# EAGLE schematic IoT Node(Ver1.0) (EAGLE 9.3.0)
test
Assembly variants: Base
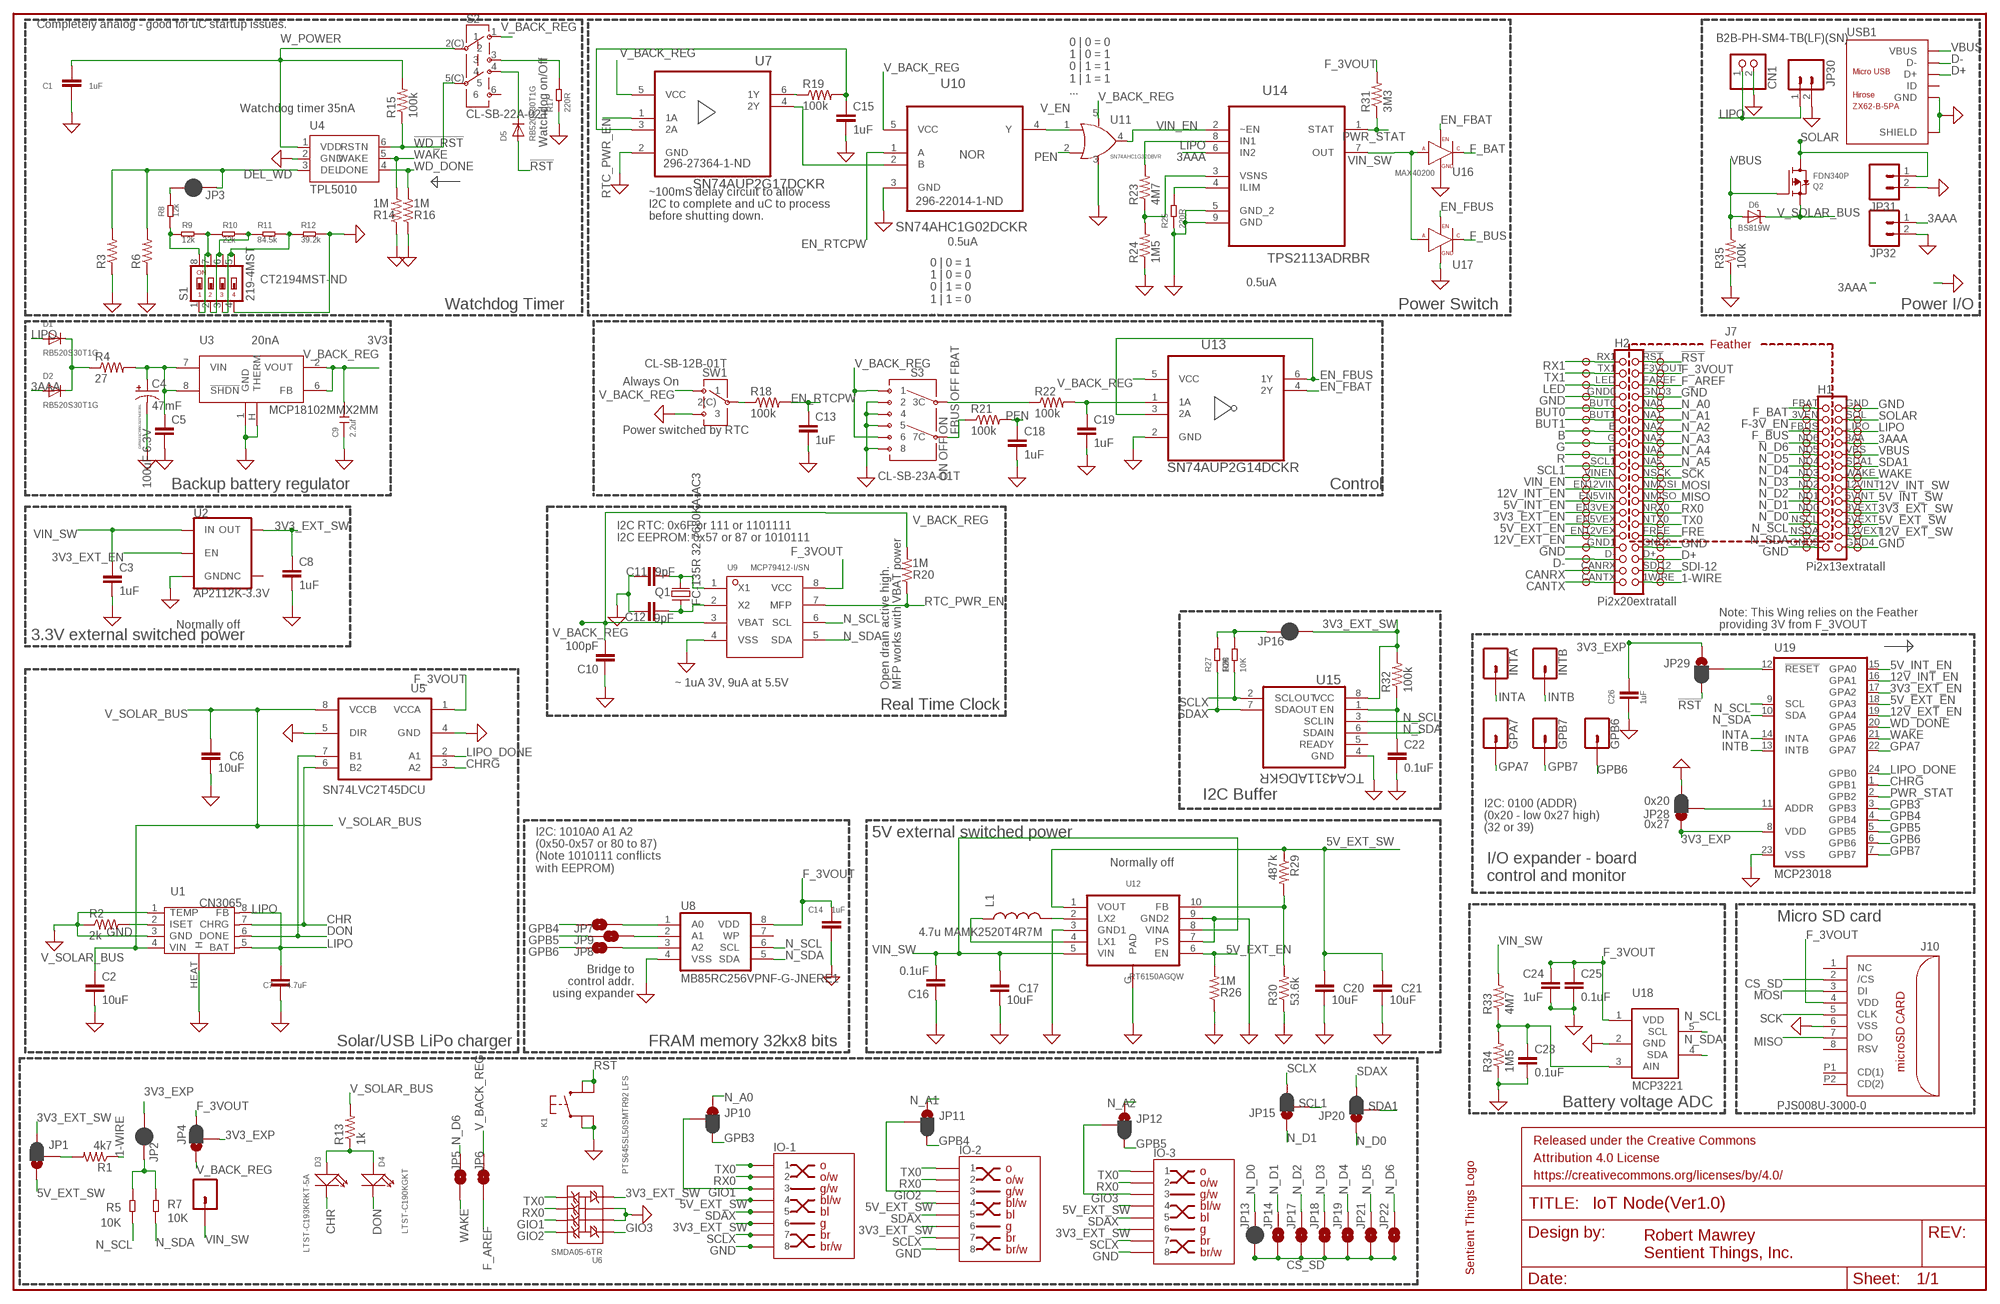
[diagram p0: schematic, sheet 1]

## Parts
C1  1uF  CAP0603-CAP  [0603-CAP]
C2  10uF  CAP0805  [0805]
C3  1uF  CAP0603-CAP  [0603-CAP]
C4  47mF  CAP_POL-SUPER  [CAP-10.5MM]
C5  100uF 6.3V  C-EUC1206  [C1206]  (not fitted in variant Base)
C6  10uF  CAP0805  [0805]
C7  4.7uF  CAP0805  [0805]
C8  1uF  CAP0603-CAP  [0603-CAP]
C9  2.2uf  CERAMIC-2.2UF-10V-10%-X7R(0603)  [C0603]
C10  100pF  CAP0805  [0805]
C11  9pF  CAP_NONE_POL  [0603]
C12  9pF  CAP_NONE_POL  [0603]
C13  1uF  CAP0603-CAP  [0603-CAP]
C14  1uF  CAP0603-CAP  [0603-CAP]
C15  1uF  CAP0603-CAP  [0603-CAP]
C16  0.1uF  0.1UF-25V(+80/-20%)(0603)  [0603-CAP]
C17  10uF  CAP0805  [0805]
C18  1uF  CAP0603-CAP  [0603-CAP]
C19  1uF  CAP0603-CAP  [0603-CAP]
C20  10uF  CAP0805  [0805]
C21  10uF  CAP0805  [0805]
C22  0.1uF  0.1UF-25V(+80/-20%)(0603)  [0603-CAP]
C23  0.1uF  0.1UF-25V(+80/-20%)(0603)  [0603-CAP]
C24  1uF  CAP0603-CAP  [0603-CAP]
C25  0.1uF  0.1UF-25V(+80/-20%)(0603)  [0603-CAP]
C26  1uF  CAP0603-CAP  [0603-CAP]
CN1  B2B-PH-SM4-TB(LF)(SN)  JST_2PIN-SMT  [JST-PH-2-SMT]
D1  RB520S30T1G  DIODESOD-523  [SOD-523]
D2  RB520S30T1G  DIODESOD-523  [SOD-523]
D3  LTST-C193KRKT-5A  LED-0603  [D0603]
D4  LTST-C190KGKT  LED-0603  [D0603]
D5  RB520S30T1G  DIODESOD-523  [SOD-523]
D6  BS819W  DIODE-SCHOTTKYSOD-123  [SOD-123]
FRAME1  FRAME-LEDGER  [CREATIVE_COMMONS]
GPA7  M01SMD-4.5X1.5  [PAD-1.5X4.5]  (not fitted in variant Base)
GPB6  M01SMD-4.5X1.5  [PAD-1.5X4.5]  (not fitted in variant Base)
GPB7  M01SMD-4.5X1.5  [PAD-1.5X4.5]  (not fitted in variant Base)
H1  Pi2x13extratall  IOTNODE2X13PLACEMENT  [2X13PLACEMENT]
H2  Pi2x20extratall  IOTNODE2X20PLACEMENT  [2X20PLACEMENT]
INTA  M01SMD-4.5X1.5  [PAD-1.5X4.5]  (not fitted in variant Base)
INTB  M01SMD-4.5X1.5  [PAD-1.5X4.5]  (not fitted in variant Base)
IO-1  RJ45-8NODE-HOR  [73304111LF]
IO-2  RJ45-8NODE-HOR  [73304111LF]
IO-3  RJ45-8NODE-HOR  [73304111LF]
J1  CONN_01  [1X01]  (not fitted in variant Base)
J5  M20IOTNODE  [M20NODE]  (not fitted in variant Base)
J6  M20IOTNODE  [M20NODE]  (not fitted in variant Base)
J7  IOTNODEDOUBLE  [IOTNODE]  (not fitted in variant Base)
J8  M13NODE  [1X13NODE]  (not fitted in variant Base)
J9  M13NODE  [1X13NODE]  (not fitted in variant Base)
J10  PJS008U-3000-0  MICROSD_SPI_MODE-VERTICAL  [MICROSDYAMAICHI]
JP1  JUMPER-SMT_3_1-NC_PASTE_NO-SILK  [SMT-JUMPER_3_1-NC_PASTE_NO-SILK]  (not fitted in variant Base)
JP2  JUMPER-SMT_2_NC_PASTE_NO-SILK  [SMT-JUMPER_2_NC_PASTE_NO-SILK]  (not fitted in variant Base)
JP3  JUMPER-SMT_2_NC_PASTE_NO-SILK  [SMT-JUMPER_2_NC_PASTE_NO-SILK]  (not fitted in variant Base)
JP4  JUMPER-SMT_3_1-NC_PASTE_NO-SILK  [SMT-JUMPER_3_1-NC_PASTE_NO-SILK]  (not fitted in variant Base)
JP5  JUMPER-SMT_2_NO_NO-SILK  [SMT-JUMPER_2_NO_NO-SILK]
JP6  JUMPER-SMT_2_NO_NO-SILK  [SMT-JUMPER_2_NO_NO-SILK]  (not fitted in variant Base)
JP7  JUMPER-SMT_2_NO_NO-SILK  [SMT-JUMPER_2_NO_NO-SILK]  (not fitted in variant Base)
JP8  JUMPER-SMT_2_NO_NO-SILK  [SMT-JUMPER_2_NO_NO-SILK]  (not fitted in variant Base)
JP9  JUMPER-SMT_2_NO_NO-SILK  [SMT-JUMPER_2_NO_NO-SILK]  (not fitted in variant Base)
JP10  JUMPER-SMT_3_1-NC_PASTE_NO-SILK  [SMT-JUMPER_3_1-NC_PASTE_NO-SILK]  (not fitted in variant Base)
JP11  JUMPER-SMT_3_1-NC_PASTE_NO-SILK  [SMT-JUMPER_3_1-NC_PASTE_NO-SILK]  (not fitted in variant Base)
JP12  JUMPER-SMT_3_1-NC_PASTE_NO-SILK  [SMT-JUMPER_3_1-NC_PASTE_NO-SILK]  (not fitted in variant Base)
JP13  JUMPER-SMT_2_NC_PASTE_NO-SILK  [SMT-JUMPER_2_NC_PASTE_NO-SILK]  (not fitted in variant Base)
JP14  JUMPER-SMT_2_NO_NO-SILK  [SMT-JUMPER_2_NO_NO-SILK]  (not fitted in variant Base)
JP15  JUMPER-SMT_3_1-NC_PASTE_NO-SILK  [SMT-JUMPER_3_1-NC_PASTE_NO-SILK]
JP16  JUMPER-SMT_2_NC_PASTE_NO-SILK  [SMT-JUMPER_2_NC_PASTE_NO-SILK]  (not fitted in variant Base)
JP17  JUMPER-SMT_2_NO_NO-SILK  [SMT-JUMPER_2_NO_NO-SILK]  (not fitted in variant Base)
JP18  JUMPER-SMT_2_NO_NO-SILK  [SMT-JUMPER_2_NO_NO-SILK]  (not fitted in variant Base)
JP19  JUMPER-SMT_2_NO_NO-SILK  [SMT-JUMPER_2_NO_NO-SILK]  (not fitted in variant Base)
JP20  JUMPER-SMT_3_1-NC_PASTE_NO-SILK  [SMT-JUMPER_3_1-NC_PASTE_NO-SILK]
JP21  JUMPER-SMT_2_NO_NO-SILK  [SMT-JUMPER_2_NO_NO-SILK]  (not fitted in variant Base)
JP22  JUMPER-SMT_2_NO_NO-SILK  [SMT-JUMPER_2_NO_NO-SILK]  (not fitted in variant Base)
JP28  JUMPER-SMT_3_1-NC_PASTE_NO-SILK  [SMT-JUMPER_3_1-NC_PASTE_NO-SILK]  (not fitted in variant Base)
JP29  JUMPER-SMT_3_1-NC_PASTE_NO-SILK  [SMT-JUMPER_3_1-NC_PASTE_NO-SILK]  (not fitted in variant Base)
JP30  M021X02_LOCK_FEM  [1X02_LOCK_FEM]  (not fitted in variant Base)
JP31  M02SOCK  [1X02-3.5-HOR]
JP32  M02PLUG  [1X02_3.5TERM]  (not fitted in variant Base)
K1  PTS645SL50SMTR92 LFS  SMD-SWITCH-TACTILE-SPST-NO(4P-D6.0MM)-TL3301  [TACTILE6MM-ESWITCH]
L1  4.7u MAMK2520T4R7M  INDUCTOR-SHIELD  [2520]
N1  SENTIENTLOGO-ULP  [SENTIENT_THINGS+50MM_TPLACE_BMP]
Q1  FC-135R 32.7680KA-AC3  Q_FC135  [FC135]
Q2  FDN340P  MOSFET-P  [SOT23-R]
R1  4k7  RESISTOR0603-RES  [0603-RES]
R2  2k  R-US_R0603  [R0603]
R3  RESISTOR0603-RES  [0603-RES]  (not fitted in variant Base)
R4  27  RESISTOR0603-RES  [0603-RES]
R5  10K  SMD-RES-10K-1%-1/10W(0603)  [R0603]
R6  RESISTOR0603-RES  [0603-RES]  (not fitted in variant Base)
R7  10K  SMD-RES-10K-1%-1/10W(0603)  [R0603]
R8  12k  SMD-RES-12K-1%-1/10W(0603)  [R0603]
R9  12k  SMD-RES-12K-1%-1/10W(0603)  [R0603]
R10  22k  SMD-RES-22K-5%-1/10W(0603)  [R0603]
R11  84.5k  R-0603  [0603]
R12  39.2k  R-0603  [0603]
R13  1k  R-US_R0603  [R0603]
R14  1M  R_0603  [0603]
R15  100k  RESISTOR0603-RES  [0603-RES]
R16  1M  R_0603  [0603]
R17  220R  SMD-RES-220R-5%-1/10W(0603)  [R0603]
R18  100k  RESISTOR0603-RES  [0603-RES]
R19  100k  RESISTOR0603-RES  [0603-RES]
R20  1M  R_0603  [0603]
R21  100k  RESISTOR0603-RES  [0603-RES]
R22  100k  RESISTOR0603-RES  [0603-RES]
R23  4M7  RESISTOR0603-RES  [0603-RES]
R24  1M5  RESISTOR0603-RES  [0603-RES]
R25  220R  SMD-RES-220R-5%-1/10W(0603)  [R0603]
R26  1M  R_0603  [0603]
R27  10K  SMD-RES-10K-1%-1/10W(0603)  [R0603]
R28  10K  SMD-RES-10K-1%-1/10W(0603)  [R0603]
R29  487k  RESISTOR0603-RES  [0603-RES]
R30  53.6k  RESISTOR0603-RES  [0603-RES]
R31  3M3  RESISTOR0603-RES  [0603-RES]
R32  100k  RESISTOR0603-RES  [0603-RES]
R33  4M7  RESISTOR0603-RES  [0603-RES]
R34  1M5  RESISTOR0603-RES  [0603-RES]
R35  100k  RESISTOR0603-RES  [0603-RES]
S1  219-4MST  SWS004  [SMS-004]
S2  CL-SB-22A-02T  SWITCH-DPDT-SMDJHOOK  [CL-SB-22A]
S3  CL-SB-23A-01T  SWITCH_DP3TSMDTOPJ  [CL-SB-23A]
SW1  CL-SB-12B-01T  SWITCH_SPDT-VERT  [CL-SB-12B]
U1  CN3065  [DFN8]
U2  AP2112K-3.3V  V_REG_AP2112K-3.3V  [SOT23-5]
U3  MCP18102MMX2MM  [8VDFN]
U4  TPL5010  [SOT23-6]
U5  SN74LVC2T45DCU  [US8-DCU]
U6  SMDA05-6TR  TVSDIODE_6-3.9MM  [SOIC-8-STANDARD]
U7  SN74AUP2G17DCKR  [SOT65P210X110-6N]
U8  MB85RC256VPNF-G-JNERE1  MB85FRAM-NARROW  [SO08]
U9  MCP79412-I/SN  RTC_MCP7941X  [RTC_MCP7941X]
U10  SN74AHC1G02DCKR  [SOT65P210X110-5N]
U11  SN74AHC1G32DBVR  OR2  [SOT23-5]
U12  RT6150AGQW  RT6150PAD  [DFN103X3]
U13  SN74AUP2G14DCKR  [SOT65P210X110-6N]
U14  TPS2113ADRBR  [SON65P300X300X100-9N]
U15  TCA4311ADGKR  TCA4311DGKR  [SOP65P490X110-8N]
U16  MAX40200  [SOT23-5]
U17  MAX40200  [SOT23-5]
U18  MCP3221  [SOT23-5]
U19  MCP23018  MCP23018MJ  [QFN24-4MM]
USB1  ZX62-B-5PA  MICRO-USB-SMD(ZX62-B-5PA)  [MICRO-USB5+6P-SMD-0.65-AB]

## Nets
1-WIRE: J6.20 J7.1WIRE R1.1
3AAA [HighCurrent]: D2.A J7.3AA J9.4 JP32.1 U14.6(IN2)
3V3_EXP [Power]: C26.1 JP2.1 JP4.2 JP28.1 JP29.1 U19.8(VDD)
3V3_EXT_EN: J5.14 J7.EN3VEX U2.3(EN) U19.17(GPA2)
3V3_EXT_SW [Power]: C8.1 IO-1.6 IO-2.6 IO-3.6 J7.3VEXT J9.10 JP1.3 JP16.1 R32.2 U2.5(OUT) U6.8 U15.8(VCC)
5V_EXT_EN: J5.15 J7.EN5VEX R26.2 U12.6(EN) U19.18(GPA3)
5V_EXT_SW [Power]: C20.1 C21.1 IO-1.4 IO-2.4 IO-3.4 J7.5VEXT J9.11 JP1.1 R29.1 U12.1(VOUT)
5V_INT_EN: J5.13 J7.EN5VIN U19.15(GPA0)
5V_INT_SW: J7.5VINT J9.9
12V_EXT_EN: J5.16 J7.EN12VEX U19.19(GPA4)
12V_EXT_SW: J7.12VEXT J9.12
12V_INT_EN: J5.12 J7.EN12VIN U19.16(GPA1)
12V_INT_SW: J7.12VINT J9.8
!RESET: JP29.2 U19.12(!RESET)
!RST: D5.A J6.1 J7.!RST JP29.3 K1.2(B0) K1.3(B1)
!WD_RST: R15.1 S2.5(C) U4.6(RSTN)
B: J5.7 J7.B
BUT0: J5.5 J7.BUT0
BUT1: J5.6 J7.BUT1
CANRX: J5.19 J7.CANRX
CANTX: J5.20 J7.CANTX
CHR: D3.- U1.7(CHRG) U5.6(B2)
CHRG: U5.3(A2) U19.1(GPB1)
CS_SD: J10.2(/CS) JP13.1 JP14.1 JP17.1 JP18.1 JP19.1 JP21.1 JP22.1
D+: J6.18 J7.D+ USB1.3(D+)
D-: J5.18 J7.D- USB1.2(D-)
DEL_WD: JP3.1 R3.2 R6.2 U4.3(DEL)
DON: D4.- U1.6(DONE) U5.7(B1)
EN_FBAT: U13.4(2Y) U16.3(EN)
EN_FBUS: U13.3(2A) U13.6(1Y) U17.3(EN)
EN_RTCPW: C13.1 R18.2 U10.1(A)
F-3V_EN: J7.3VEN J8.2
F_3VOUT [Power]: C14.1 C24.1 C25.1 J6.2 J7.F3VOUT J10.4(VDD) JP4.3 R31.2 U5.1(VCCA) U8.8(VDD) U9.8(VCC) U18.1(VDD)
F_AREF: J6.3 J7.FAREF JP6.2
F_BAT [HighCurrent]: J7.FBAT J8.1 U16.5(C)
F_BUS [HighCurrent]: J7.FBUS J8.3 U17.5(C)
FA0: JP7.2 U8.1(A0)
FA1: JP9.2 U8.2(A1)
FA2: JP8.2 U8.3(A2)
FRE: J6.16 J7.FREE
G: J5.8 J7.G
GIO1: IO-1.3 JP10.2 U6.3
GIO2: IO-2.3 JP11.2 U6.4
GIO3: IO-3.3 JP12.2 U6.5
GND [Power]: C1.2 C2.2 C3.2 C4.-VE(-) C5.2 C6.2 C7.2 C8.2 C9.1 C10.1 C11.1(ANODE) C12.1(ANODE) C13.2 C14.2 C15.2 C16.1 C17.2 C18.2 C19.2 C20.2 C21.2 C22.2 C23.2 C24.2 C25.2 C26.2 CN1.2 IO-1.8 IO-2.8 IO-3.8 J5.4 J5.17 J6.4 J6.17 J7.GND J7.GND0 J7.GND1 J7.GND2 J7.GND3 J7.GND4 J7.GND5 J8.13 J9.1 J9.13 J10.6(VSS) JP28.3 JP30.2 JP31.2 JP32.2 K1.1(A0) K1.4(A1) R2.1 R3.1 R6.1 R12.2 R14.1 R16.1 R17.1 R24.1 R25.1 R26.1 R30.1 R34.1 R35.1 S1.4 S3.2 S3.4 S3.5 S3.8 SW1.3 U1.1(TEMP) U1.3(GND) U1.HEAT(H) U2.2(GND) U3.1(GND) U3.H(THERM) U4.2(GND) U5.4(GND) U5.5(DIR) U6.6 U6.7 U7.2(GND) U8.4(VSS) U9.4(VSS) U10.3(GND) U11.3(G) U12.3(GND1) U12.7(PS) U12.9(GND2) U12.G(PAD) U13.2(GND) U14.5(GND_2) U14.9(GND) U15.4(GND) U16.2(G) U17.2(G) U18.2(GND) U19.23(VSS) USB1.5(GND) USB1.P1(SHIELD) USB1.P2(SHIELD) USB1.P3(SHIELD) USB1.P4(SHIELD) USB1.P5(SHIELD) USB1.P6(SHIELD)
GPA7: GPA7.P$1 U19.22(GPA7)
GPB3: JP10.3 U19.3(GPB3)
GPB4: JP7.1 JP11.3 U19.4(GPB4)
GPB5: JP9.1 JP12.3 U19.5(GPB5)
GPB6: GPB6.P$1 JP8.1 U19.6(GPB6)
GPB7: GPB7.P$1 U19.7(GPB7)
I2CPWR: JP2.2 R5.2 R7.2
INTA: INTA.P$1 U19.14(INTA)
INTB: INTB.P$1 U19.13(INTB)
LED: J5.3 J7.LED
LIPO [HighCurrent]: C7.1 CN1.1 D1.A J7.LIPO J9.3 JP30.1 R23.2 U1.5(BAT) U1.8(FB) U14.8(IN1)
LIPO_DONE: U5.2(A1) U19.24(GPB0)
MISO: J6.13 J7.NMISO J10.7(DO)
MOSI: J6.12 J7.NMOSI J10.3(DI)
N$1: JP3.2 R8.2
N$2: R2.2 U1.2(ISET)
N$3: R17.2 S2.3
N$4: R19.1 U7.6(1Y)
N$5: D3.+ D4.+ R13.1
N$6: R18.1 SW1.C(2)(2(C))
N$7: R25.2 U14.4(ILIM)
N$8: JP28.2 U19.11(ADDR)
N$9: R23.1 R24.2 U14.3(VSNS)
N$10: D1.K(C) D2.K(C) R4.1
N$11: D5.K(C) S2.4
N$12: C15.1 R19.2 U7.3(2A)
N$13: C11.2(CATHODE) Q1.X2 U9.1(X1)
N$14: C12.2(CATHODE) Q1.X1 U9.2(X2)
N$15: JP1.2 R1.2
N$16: U7.4(2Y) U10.2(B)
N$17: R9.2 R10.1 S1.1 S1.7
N$18: R10.2 R11.1 S1.2 S1.6
N$19: R11.2 R12.1 S1.3 S1.5
N$20: R8.1 R9.1 S1.8
N$21: C23.1 R33.1 R34.2 U18.3(AIN)
N$22 [Power]: JP16.2 R27.2 R28.2
N$23: L1.L2 U12.2(LX2)
N$24: L1.L1 U12.4(LX1)
N$25: R29.2 R30.2 U12.10(FB)
N$26: R21.1 S3.7(C)(7C)
N$27: C22.1 R32.1 U15.1(EN)
N$29: C19.1 R22.2 U13.1(1A)
N$33: R22.1 S3.3(C)(3C)
N_A0: J6.5 J7.NA0 JP10.1
N_A1: J6.6 J7.NA1 JP11.1
N_A2: J6.7 J7.NA2 JP12.1
N_A3: J6.8 J7.NA3
N_A4: J6.9 J7.NA4
N_A5: J6.10 J7.NA5
N_D0: J7.ND0 J8.10 JP13.2 JP20.1
N_D1: J7.ND1 J8.9 JP14.2 JP15.1
N_D2: J7.ND2 J8.8 JP17.2
N_D3: J7.ND3 J8.7 JP18.2
N_D4: J7.ND4 J8.6 JP19.2
N_D5: J7.ND5 J8.5 JP21.2
N_D6: J7.ND6 J8.4 JP5.1 JP22.2
N_SCL: J7.NSCL J8.11 R5.1 U8.6(SCL) U9.6(SCL) U15.3(SCLIN) U18.5(SCL) U19.9(SCL)
N_SDA: J7.NSDA J8.12 R7.1 U8.5(SDA) U9.5(SDA) U15.6(SDAIN) U18.4(SDA) U19.10(SDA)
PEN: C18.1 R21.2 U11.2(B)
PWR_STAT: R31.1 U14.1(STAT) U19.2(GPB2)
R: J5.9 J7.R
RTC_PWR_EN: R20.1 U7.1(1A) U9.7(MFP)
RX0: IO-1.2 IO-2.2 IO-3.2 J6.14 J7.NRX0 U6.2
RX1: J5.1 J7.RX1
SCK: J6.11 J7.NSCK J10.5(CLK)
SCL1: J5.10 J7.SCL1 JP15.2
SCLX: IO-1.7 IO-2.7 IO-3.7 JP15.3 R28.1 U15.2(SCLOUT)
SDA1: J7.SDA1 J9.6 JP20.2
SDAX: IO-1.5 IO-2.5 IO-3.5 JP20.3 R27.1 U15.7(SDAOUT)
SDI-12: J6.19 J7.SDI12
SOLAR [Power]: J7.SOL J9.2 JP31.1 Q2.3(D)
TX0: IO-1.1 IO-2.1 IO-3.1 J6.15 J7.NTX0 U6.1
TX1: J5.2 J7.TX1
V_BACK: C4.+VE(+) C5.1 R4.2 U3.7(VIN) U3.8(!SHDN)
V_BACK_REG: C9.2 C10.2 JP4.1 JP6.1 R20.2 S2.1 S3.1 S3.6 SW1.1 U3.2(VOUT) U3.6(FB) U7.5(VCC) U9.3(VBAT) U10.5(VCC) U11.5(V) U13.5(VCC)
V_EN: U10.4(Y) U11.1(A)
V_SOLAR_BUS: C2.1 C6.1 D6.C Q2.2(S) R13.2 U1.4(VIN) U5.8(VCCB)
VBUS [Power]: D6.A J7.VBS J9.5 Q2.1(G) R35.2 USB1.1(VBUS)
VIN_EN: J5.11 J7.VINEN U11.4(Y) U14.2(~EN)
VIN_SW [HighCurrent]: C3.1 C16.2 C17.1 J1.1 R33.2 U2.1(IN) U12.5(VIN) U12.8(VINA) U14.7(OUT) U16.1(A) U17.1(A)
W_POWER: C1.1 R15.2 S2.2(C) U4.1(VDD)
WAKE: J7.WAKE J9.7 JP5.2 R14.2 U4.5(WAKE) U19.21(GPA6)
WD_DONE: R16.2 U4.4(DONE) U19.20(GPA5)
Unconnected: J10.1(NC) J10.8(RSV) J10.P1(CD(1)) J10.P2(CD(2)) S2.6 U2.4(NC) U8.7(WP) U15.5(READY) USB1.4(ID)

## Notes on the sheet
- Completely analog - good for uC startup issues.
- 0 | 0 = 0
  1 | 0 = 1
  0 | 1 = 1
  1 | 1 = 1
  ...
- Watchdog timer 35nA
- Watchdog on/Off
- NOR
- 296-27364-1-ND
- ~100mS delay circuit to allow
  I2C to complete and uC to process
  before shutting down.
- 296-22014-1-ND
- 0.5uA
- CT2194MST-ND | 0.5uA
- Watchdog Timer | Power Switch | Power I/O
- 0 | 0 = 1
  1 | 0 = 0
  0 | 1 = 0
  1 | 1 = 0
  ...
- 20nA | 3V3
- Always On
  
  
  
  Power switched by RTC
- FBUS OFF FBAT
- GRM31CR60J107ME39L
- Backup battery regulator | ON OFF ON
- Control
- I2C RTC: 0x6F or 111 or 1101111
  I2C EEPROM: 0x57 or 87 or 1010111
- Normally off
- Note: This Wing relies on the Feather
  providing 3V from F_3VOUT
- 3.3V external switched power
- ~ 1uA 3V, 9uA at 5.5V
- Open drain active high.
  MFP works with VBAT power
- Real Time Clock
- I2C Buffer | 0x20
- 0x27
- I2C: 0100 (ADDR) 
  (0x20 - low 0x27 high)
  (32 or 39)
- 5V external switched power
- Normally off
- I2C: 1010A0 A1 A2
  (0x50-0x57 or 80 to 87)
  (Note 1010111 conflicts
  with EEPROM)
- I/O expander - board
  control and monitor
- Micro SD card
- Bridge to
  control addr.
  using expander
- Solar/USB LiPo charger | FRAM memory 32kx8 bits
- Battery voltage ADC
- Robert Mawrey
  Sentient Things, Inc.

## Library data of the parts
C1 C3 C8 C13-C15 C18 C19 C24 C26 = Mawrey:CAP: Capacitor Standard 0603 ceramic capacitor, and 0.1" leaded capacitor.; PARTNO: CL10A105KP8NNNC
C2 C6 C17 C20 C21 = Mawrey:CAP: Capacitor Standard 0603 ceramic capacitor, and 0.1" leaded capacitor.; PARTNO: CL21A106KPFNNNE
C4 = Mawrey:CAP_POL: Capacitor Polarized These are standard SMD and PTH capacitors. Normally 10uF, 47uF, and 100uF in electrolytic and tantalum varieties. Always verify the external diameter of the through hole cap, it varies with capacity, voltage, and manufacturer. The EIA devices should be standard.; DESCRIPTION: CAP SUPER 0.33F 5.5V RADIAL; EACH: 1.0346; MFPN: EEC-S0HD334V; MFR: Panasonic - ECG; PARTNO: FC0H473ZFTBR24; VEND: Digi-Key; VPN: P11065-ND
C5 = rcl:C-EU: CAPACITOR, European symbol; PARTNO: DNP; SPICEPREFIX: C
C7 = Mawrey:CAP: Capacitor Standard 0603 ceramic capacitor, and 0.1" leaded capacitor.; PARTNO: CL10A475KP8NNNC
C9 = Seeed-Capacitor:CERAMIC-2.2UF-10V-10%-X7R(0603): 302010054; MPN: CC0603KRX7R6BB225; PARTNO: CL10A106MQ8NNNC
C10 = Mawrey:CAP: Capacitor Standard 0603 ceramic capacitor, and 0.1" leaded capacitor.; DESCRIPTION: CAP CER 100PF 50V 5% NP0 0805; EACH: 0.036; MFPN: 500R15N101JV4T; MFR: Johanson Dielectrics Inc; PARTNO: CL21C101JC61PNC; VEND: Digi-Key; VPN: 709-1176-1-ND
C11 C12 = Particle:CAP_NONE_POL; PARTNO: C1608C0G1H090D080AA
C16 C22 C23 C25 = SparkFun-Capacitors:0.1UF-25V(+80/-20%)(0603): CAP-00810 Ceramic Standard decoupling cap; PARTNO: CL10F104ZB8NNNC; PROD_ID: CAP-00810
CN1 = Mawrey:JST_2PIN: JST 2-Pin Connectors of various flavors SMT-RA (S2B-PH-SM4) 4UConnector #17311 SMT (B2B-PH-SM4) THM-RA (S2B-PH) THM (B2B-PH); PARTNO: B2B-PH-SM4-TB(LF)(SN)?
D1 D2 D5 = adafruit:DIODE: Diode SMADIODE - SMA Surface Mount Package 20V 1A Schottky Diode Digikey: 641-1014-6-ND DO-1N4148 - Through Hole Small Current Diode SOD-123 20V 1 A (.5mV Vf) Schottky Diode - Digikey: MBRX120TPMSCT-ND SOD-323 10V 570mA (.38mV Vf, 3ns) Schottky Diode - Digikey: ZLLS410CT-ND SOD-523 30V 30mA Schottky Diode (RB751S-40TE61) - Digikey: RB751S-40TE61CT-ND SOT23-R/W - SOT23 Package (R = Solder Paste/Reflow Ovens, W = Hand-Soldering) BAT54Film 40V 300mA - Digikey: 497-7162-1-ND; PARTNO: RB520S30T1G
D3 = discrete:LED*; PARTNO: LTST-C193KRKT-5A
D4 = discrete:LED*; PARTNO: LTST-C190KGKT
D6 = microbuilder:DIODE-SCHOTTKY; PARTNO: B5819WS-TP
FRAME1 = mawrey-aesthetics:FRAME-LEDGER: Schematic Frame Standard 11x14 US Ledger frame
GPA7 GPB6 GPB7 INTA INTB = Mawrey:M01: Header 1 Standard 1-pin 0.1" header. Use with straight break away headers (SKU : PRT-00116), right angle break away headers (PRT-00553), swiss pins (PRT-00743), machine pins (PRT-00117), and female headers (PRT-00115).; PARTNO: DNP
H1 = Mawrey:IOTNODE2X13PLACEMENT; PARTNO: 2X13-ExtraTall
H2 = Mawrey:IOTNODE2X20PLACEMENT; PARTNO: 2X20ExtraTall
IO-1-IO-3 = Mawrey:RJ45-8: RJ45 Jack Simple RJ45, 8-pin connection - connector for common Cat5, Cat5e, and Cat6 Ethernet cables. Footprint not yet proven in production. Connector sku is PRT-00643; Breakout PCB sku is BOB-00716.; PARTNO: 73304-111LF
J1 = SparkFun-Connectors:CONN_01: Single connection point. Often used as Generic Header-pin footprint for 0.1 inch spaced/style header connections On any of the 0.1 inch spaced packages, you can populate with these: Break Away Headers - Straight <https://www.sparkfun.com/products/116> (PRT-00116) Break Away Male Headers - Right Angle <https://www.sparkfun.com/products/553> (PRT-00553) Female Headers <https://www.sparkfun.com/products/115> (PRT-00115) Break Away Headers - Machine Pin <https://www.sparkfun.com/products/117> (PRT-00117) Break Away Female Headers - Swiss Machine Pin <https://www.sparkfun.com/products/743> (PRT-00743) This device is also useful as a general connection point to wire up your design to another part of your project. Our various solder wires solder well into these plated through hole pads. Hook-Up Wire - Assortment (Stranded, 22 AWG) <https://www.sparkfun.com/products/11375> (PRT-11375) Hook-Up Wire - Assortment (Solid Core, 22 AWG) <https://www.sparkfun.com/products/11367> (PRT-11367) View the entire wire category on our website here <https://www.sparkfun.com/categories/141> Special notes: SMTSO-256-ET is a "flush mount" nut for a 4-40 screw. We mostly use this on specialty testbeds; it is a nice way to connect hardware to your PCB at an adjustable hieght. Also note, the SNAP packages are for using a snappable style connector. We sell a baggie of snaps and they are also used on two LilyPad designs: Snap Assortment - 30 pack (male and female) <https://www.sparkfun.com/products/11347> (DEV-11347) LilyPad Arduino SimpleSnap <https://www.sparkfun.com/products/10941> (DEV-10941) LilyPad SimpleSnap Protoboard <https://www.sparkfun.com/products/10940> (DEV-10940); PARTNO: DNP
J5 J6 = Mawrey:M20IOTNODE; PARTNO: DNP
J7 = Mawrey:IOTNODEDOUBLE; PARTNO: DNP
J8 J9 = Mawrey:M13NODE; PARTNO: DNP
J10 = Mawrey:MICROSD_SPI_MODE: MOLEX - 49225-0821 - CONNECTEUR MICRO SD PUSH/PUSH REV Fabricant: MOLEX Code commande Farnell: 1366700 <http://fr.farnell.com/molex/49225-0821/connecteur-micro-sd-push-push-rev/dp/1366700?Ntt=1366700> Référence fabricant: 49225-0821; PARTNO: PJS008U-3000-0
JP1 JP4 JP10-JP12 JP15 JP20 JP28 JP29 = SparkFun-Jumpers:JUMPER-SMT_3_1-NC_PASTE: Normally closed solder jumper (1 of 2 connections) This jumper has an aperture in the stencil to allow solder paste to bridge one of the two connections. One connection is normally closed (NC), while the other is normally open (NO). Wick off the solder to open the connection. Reapply solder to reclose the connection. Apply solder to the other side instead to change the current path.; PARTNO: DNP
JP2 JP3 JP13 JP16 = SparkFun-Jumpers:JUMPER-SMT_2_NC_PASTE: Normally closed solder jumper This jumper has an aperture in the stencil to allow solder paste to bridge the split in the wire so it's normally closed (NC). Wick off the solder to open the connection. Reapply solder to reclose the connection.; PARTNO: DNP
JP5-JP9 JP14 JP17-JP19 JP21 JP22 = SparkFun-Jumpers:JUMPER-SMT_2_NO: Normally open jumper This jumper has two pads in close proximity to each other. Apply solder to close the connection. Round pads are easier to solder for beginners, but are a lot larger. SparkFun Product that uses the round pads: SparkFun EL Sequencer <https://www.sparkfun.com/products/12781>; PARTNO: DNP
JP30 = Mawrey:M02: Header 2 Standard 2-pin 0.1" header. Use with straight break away headers (SKU : PRT-00116), right angle break away headers (PRT-00553), swiss pins (PRT-00743), machine pins (PRT-00117), and female headers (PRT-00115). Molex polarized connector foot print use with SKU : PRT-08233 with associated crimp pins and housings.; PARTNO: 691322110002
JP31 = mawrey-connectors:M02: Header 2 Standard 2-pin 0.1" header. Use with straight break away headers (SKU : PRT-00116), right angle break away headers (PRT-00553), swiss pins (PRT-00743), machine pins (PRT-00117), and female headers (PRT-00115). Molex polarized connector foot print use with SKU : PRT-08233 with associated crimp pins and housings.; PARTNO: DNP
JP32 = mawrey-connectors:M02: Header 2 Standard 2-pin 0.1" header. Use with straight break away headers (SKU : PRT-00116), right angle break away headers (PRT-00553), swiss pins (PRT-00743), machine pins (PRT-00117), and female headers (PRT-00115). Molex polarized connector foot print use with SKU : PRT-08233 with associated crimp pins and housings.; PARTNO: 691321100002
K1 = Mawrey:SMD-SWITCH-TACTILE-SPST-NO(4P-D6.0MM): 311020004; PARTNO: PTS645SL50SMTR92 LFS
L1 = Mawrey:INDUCTOR; PARTNO: MAMK2520T2R2M
N1 = Mawrey:SENTIENTLOGO; PARTNO: DNP
Q1 = Particle:Q; PARTNO: FC-135R 32.7680KA-AC3
Q2 = microbuilder:MOSFET-P: P-Channel Mosfet LEGEND VDS: Voltage Drain-Source ID: Drain Current RDS(ON): Drain-Source On-State Resistance VGS(TH): Gate-Source Threshold Voltage CISS: Drain-Source Input Capacitance SOT-23 Name VDS ID RDS(ON) VGS(TH) CISS Order Number IRLML5103 30V 760mA 600 mOhm -- 75pF @ 25V Digikey: IRLML5103PBFCT-ND IRLML6401 12V 4.3A 50 mOhm 950mV @ 250µA 830pF @ 10V Digikey: IRLML6401PBFTR-ND NTR0202PL 20V 400mA 800 mOhm 2.3V @ 250uA 70pF @ 5V Digikey: NTR0202PLT1GOSTR-ND NTR4101PT1G 20V 1.8A 85 mOhm 1.2V @ 250uA 675pF @ 10V Digikey: NTR4101PT1GOSCT-ND DMP2004K 20V 600mA 900 mOhm 1V @ 250uA 175pF @ 16V Digikey: DMP2004KDICT-ND PMV65XP 20V 3.9A 76 mOhm 950mV @ 1mA 725pF @ 20V Digikey: 568-2358-2-ND TO-252 Name VDS ID RDS(ON) VGS(TH) CISS Order Number AOD417 30V 25A 34 mOhm 3V @ 250µA 920pF @ 15V Digikey: 785-1106-2-ND PowerPak Name VDS ID RDS(ON) VGS(TH) CISS Order Number AON7401 30V 12A 14 mOhm 3V @ 250µA 2600pF @ 15V Digikey: 785-1302-1-ND; PARTNO: FDN340P
R1 = Mawrey:RESISTOR: Resistor Basic schematic elements and footprints for 0603, 1206, and PTH 1/10th watt (small) resistors.; PARTNO: RC0603JR-074K7L
R2 = Mawrey:R-US_: RESISTOR, American symbol; PARTNO: ERJ-3GEYJ202V
R3 R6 = Mawrey:RESISTOR: Resistor Basic schematic elements and footprints for 0603, 1206, and PTH 1/10th watt (small) resistors.; PARTNO: DNP
R4 = Mawrey:RESISTOR: Resistor Basic schematic elements and footprints for 0603, 1206, and PTH 1/10th watt (small) resistors.; PARTNO: RC0603JR-0727RL
R5 R7 R27 R28 = Seeed-Resistor:SMD-RES-10K-1%-1/10W(0603): 301010299; MPN: RC0603FR-0710KL; PARTNO: ERJ-3GEYJ103V
R8 R9 = Seeed-Resistor:SMD-RES-12K-1%-1/10W(0603): 301010102; MPN: RC0603FR-0712KL; PARTNO: ERJ-3GEYJ123V; VALUE: 12K
R10 = Seeed-Resistor:SMD-RES-22K-5%-1/10W(0603): 301010132; MPN: RC0603JR-0722KL; PARTNO: ERJ-3GEYJ223V; VALUE: 22K
R11 = iotNodeTempIoT Node baseboard2:R*; PARTNO: RC0603FR-0784K5L
R12 = iotNodeTempIoT Node baseboard2:R*; PARTNO: RC0603FR-0739K2L
R13 = Mawrey:R-US_: RESISTOR, American symbol; PARTNO: ERJ-3GEYJ102V
R14 R16 R20 R26 = Particle:R_0603; PARTNO: ERJ-3GEYJ105V
R15 R18 R19 R21 R22 R32 R35 = Mawrey:RESISTOR: Resistor Basic schematic elements and footprints for 0603, 1206, and PTH 1/10th watt (small) resistors.; PARTNO: ERJ-3GEYJ104V
R17 R25 = Seeed-Resistor:SMD-RES-220R-5%-1/10W(0603): 301010163; MPN: RC0603JR-07220RL; PARTNO: ERJ-3GEYJ221V
R23 R33 = Mawrey:RESISTOR: Resistor Basic schematic elements and footprints for 0603, 1206, and PTH 1/10th watt (small) resistors.; PARTNO: ERJ-3GEYJ475V
R24 R34 = Mawrey:RESISTOR: Resistor Basic schematic elements and footprints for 0603, 1206, and PTH 1/10th watt (small) resistors.; PARTNO: ERJ-3GEYJ155V
R29 = Mawrey:RESISTOR: Resistor Basic schematic elements and footprints for 0603, 1206, and PTH 1/10th watt (small) resistors.; PARTNO: RC0603FR-07487KL
R30 = Mawrey:RESISTOR: Resistor Basic schematic elements and footprints for 0603, 1206, and PTH 1/10th watt (small) resistors.; PARTNO: RC0603FR-0753K6L
R31 = Mawrey:RESISTOR: Resistor Basic schematic elements and footprints for 0603, 1206, and PTH 1/10th watt (small) resistors.; PARTNO: ERJ-3GEYJ335V
S1 = Mawrey:SWS004: SMD Dip Switch 4 pol.; PARTNO: 219-4MST
S2 = Mawrey:SWITCH-DPDT: DPDT Version of the COM-00597 Also CL-SB-22A-01T; PARTNO: CL-SB-22A-02T
S3 = Mawrey:SWITCH_DP3T; PARTNO: CL-SB-23A-01T
SW1 = Mawrey:SWITCH_SPDT: Manufacturer Part Number CL-SB-12B-01T Description SWITCH SLIDE SPDT 200MA 12V; PARTNO: CL-SB-12B-01T
U1 = IC:CN3065; PARTNO: CN3065
U2 = SparkFun-IC-Power:V_REG_AP2112: AP2112 - 600mA CMOS LDO Regulator w/ Enable The AP2112 is CMOS process low dropout linear regulator with enable function, the regulator delivers a guaranteed 600mA (min.) continuous load current. Features Output Voltage Accuracy: ±1.5% Output Current: 600mA (Min.) Foldback Short Current Protection: 50mA Enable Function to Turn ON/OFF VOUT Low Dropout Voltage (3.3V): 250mV (Typ.) @IOUT=600mA Excellent Load Regulation: 0.2%/A (Typ.) Excellent Line Regulation: 0.02%/V (Typ.) Low Quiescent Current: 55μA (Typ.) Low Standby Current: 0.01μA (Typ.) Low Output Noise: 50μVRMS PSRR: 100Hz -65dB, 1kHz -65dB OTSD Protection Stable with 1.0μF Flexible Cap: Ceramic, Tantalum and Aluminum Electrolytic Operation Temperature Range: -40°C to 85°C ESD: MM 400V, HBM 4000V; PARTNO: AP2112K-3.3TRG; PROD_ID: VREG-12457; VALUE: 3.3V
U3 = Mawrey:MCP1810; PARTNO: MCP1810T-33I/J8A
U4 = Mawrey:TPL5010; PARTNO: TPL5010DDCT
U5 = 74LV:SN74LVC2T45: DUAL-BIT DUAL-SUPPLY BUS TRANSCEIVER With Configurable Voltage Translation and 3-State Outputs; PARTNO: SN74LVC2T45DCUR
U6 = Mawrey:TVSDIODE_6; PARTNO: SMDA05-6TR
U7 = Texas Instruments_By_element14_Batch_1:SN74AUP2G17DCKR: LOW-POWER DUAL SCHMITT-TRIGGER BUFFER; MPN: SN74AUP2G17DCKR; OC_FARNELL: -; OC_NEWARK: 74R6584; PACKAGE: SC70-6; SUPPLIER: Texas Instruments
U8 = Mawrey:MB85FRAM; PARTNO: MB85RC256VPNF-G-JNERE1
U9 = Mawrey:RTC_MCP7941X; PARTNO: MCP79412-I/SN
U10 = Texas Instruments_By_element14_Batch_1:SN74AHC1G02DCKR: SINGLE 2-INPUT POSITIVE-NOR GATE; MPN: SN74AHC1G02DCKR; OC_FARNELL: 1287442; OC_NEWARK: 26M3223; PACKAGE: SC70-5; SUPPLIER: Texas Instruments
U11 = Mawrey:OR2; PARTNO: SN74AHC1G32DBVR
U12 = Mawrey:RT6150: RT6150AGQW, Digikey 1028-1259-1-ND, Buck-Boost Switching Regulator IC Positive Adjustable 1.8V 1 Output 800mA 10-WFDFN Exposed Pad; PARTNO: RT6150AGQW
U13 = Texas Instruments_By_element14_Batch_1:SN74AUP2G14DCKR: LOW-POWER DUAL SCHMITT-TRIGGER INVERTER; MPN: SN74AUP2G14DCKR; OC_FARNELL: -; OC_NEWARK: 74R6581; PACKAGE: SC70-6; SUPPLIER: Texas Instruments
U14 = Texas Instruments_By_element14_Batch_1:TPS2113ADRBR: AUTOSWITCHING POWER MUX; MPN: TPS2113ADRBR; OC_FARNELL: -; OC_NEWARK: 74R6612; PACKAGE: SON-8; SUPPLIER: Texas Instruments
U15 = Mawrey:TCA4311DGKR: 2-WIRE BUS BUFFERS; MPN: TCA4311DGKR; OC_FARNELL: -; OC_NEWARK: 45P8199; PACKAGE: MSOP-8; PARTNO: TCA4311ADGKR; SUPPLIER: Texas Instruments
U16 U17 = Mawrey:MAX40200: Micropower, 1A Ideal Diode; PARTNO: MAX40200AUK+T
U18 = Mawrey:MCP3221: Low-Power 12-Bit A/D Converter with I2C Interface; PARTNO: MCP3221A5T-E/OT
U19 = Mawrey:MCP23018: I/O Expander I2C Interface; PARTNO: MCP23018-E/MJ
USB1 = mawrey-connectors:MICRO-USB-SMD(ZX62-B-5PA): 320010005; MPN: ZX62-B-5PA; PARTNO: ZX62-B-5PA(33)

## Net classes
0 default: width 0.254 mm, drill 0.356 mm, clearance 0.152 mm
1 Power: width 0.508 mm, drill 0.356 mm, clearance 0.152 mm
2 HighCurrent: width 0.762 mm, drill 0.356 mm, clearance 0.152 mm